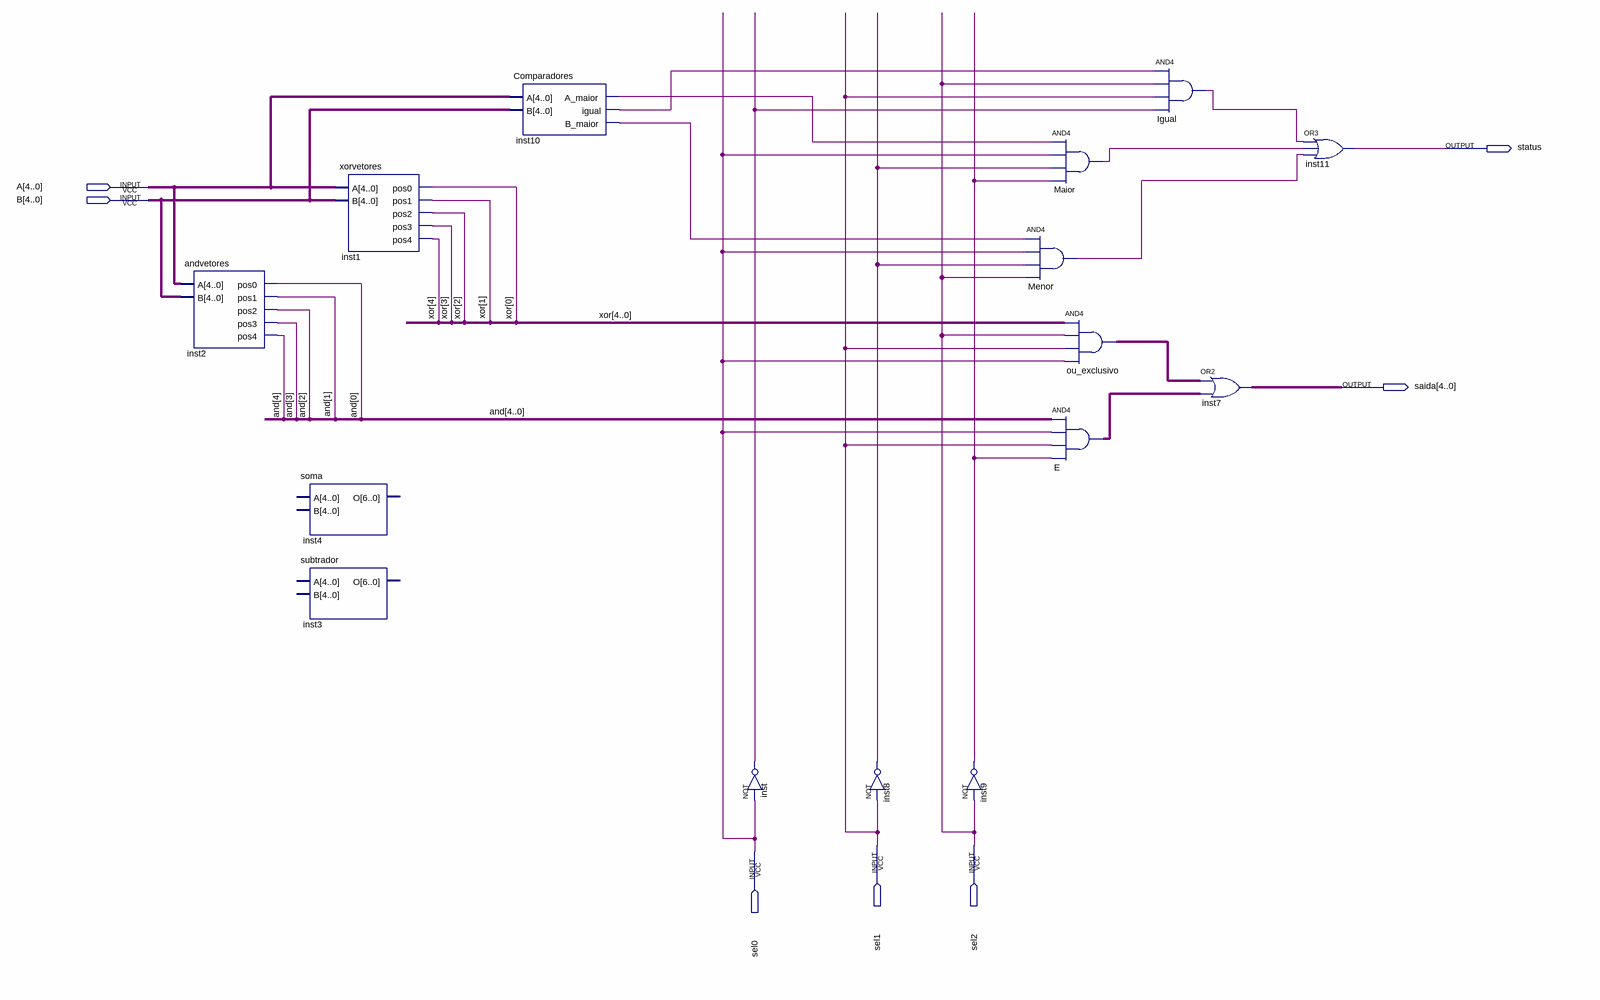
[diagram p0: schematic sheet]
// Quartus schematic base.bdf as structural Verilog: 15 symbols, 7 pins
module base (
  input  [4:0] A,
  input  [4:0] B,
  input  sel1,
  input  sel2,
  input  sel0,
  output status,
  output [4:0] saida
);

  wire Igual_out, inst8_out, inst9_out, inst10_a_maior, inst10_b_maior, inst10_igual, inst_out, Maior_out,
       Menor_out;
  wire [4:0] \and , E_out, ou_exclusivo_out, \xor ;

  andvetores inst2 (.A(A), .B(B), .pos0(\and [0]), .pos1(\and [1]), .pos2(\and [2]), .pos3(\and [3]), .pos4(\and [4]));
  xorvetores inst1 (.A(A), .B(B), .pos0(\xor [0]), .pos1(\xor [1]), .pos2(\xor [2]), .pos3(\xor [3]), .pos4(\xor [4]));
  soma inst4 ();  // open: A, B, O
  subtrador inst3 ();  // open: A, B, O
  Comparadores inst10 (.A(A), .B(B), .A_maior(inst10_a_maior), .igual(inst10_igual), .B_maior(inst10_b_maior));
  not inst (inst_out, sel0);
  not inst8 (inst8_out, sel1);
  not inst9 (inst9_out, sel2);
  and Maior (Maior_out, inst10_a_maior, sel0, inst8_out, inst9_out);
  and Menor (Menor_out, inst10_b_maior, sel0, inst8_out, sel2);
  assign ou_exclusivo_out = \xor  & {5{sel2}} & {5{sel1}} & {5{sel0}};  // AND4 ou_exclusivo, 5 bits wide
  assign E_out = \and  & {5{sel0}} & {5{sel1}} & {5{inst9_out}};  // AND4 E, 5 bits wide
  and Igual (Igual_out, inst10_igual, sel2, sel1, inst_out);
  assign saida = ou_exclusivo_out | E_out;  // OR2 inst7, 5 bits wide
  or inst11 (status, Igual_out, Maior_out, Menor_out);
endmodule
